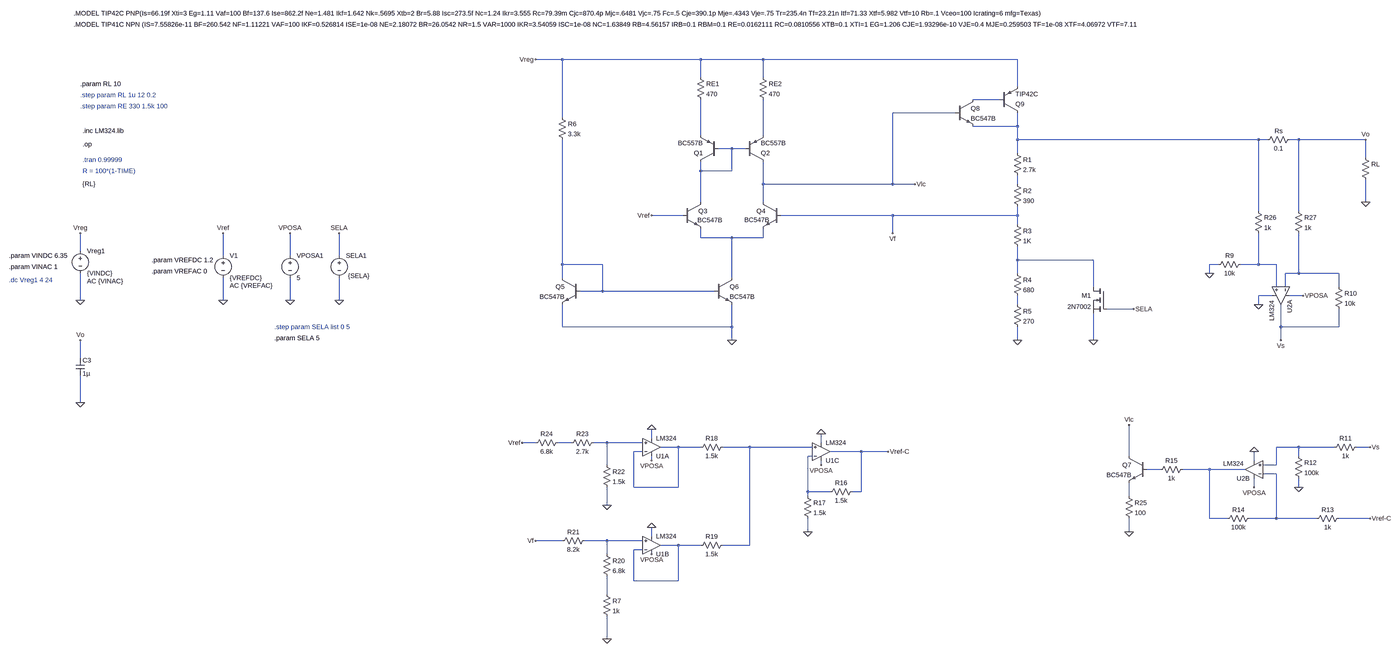
[diagram p0: schematic Simulacion - v10.asc, whole sheet]
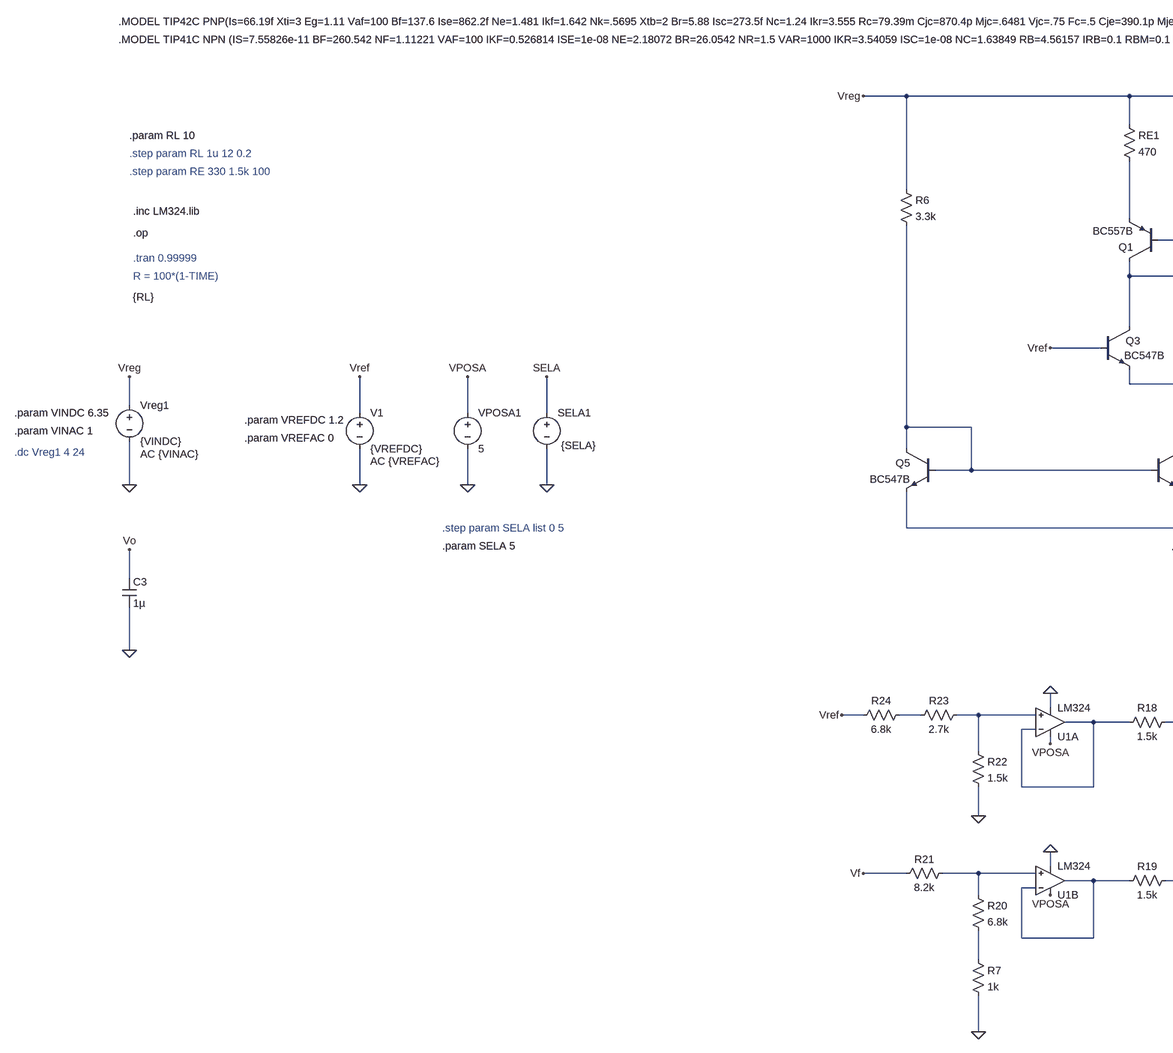
[diagram p1: schematic Simulacion - v10.asc, part, row 1 of 1, column 1 of 2]
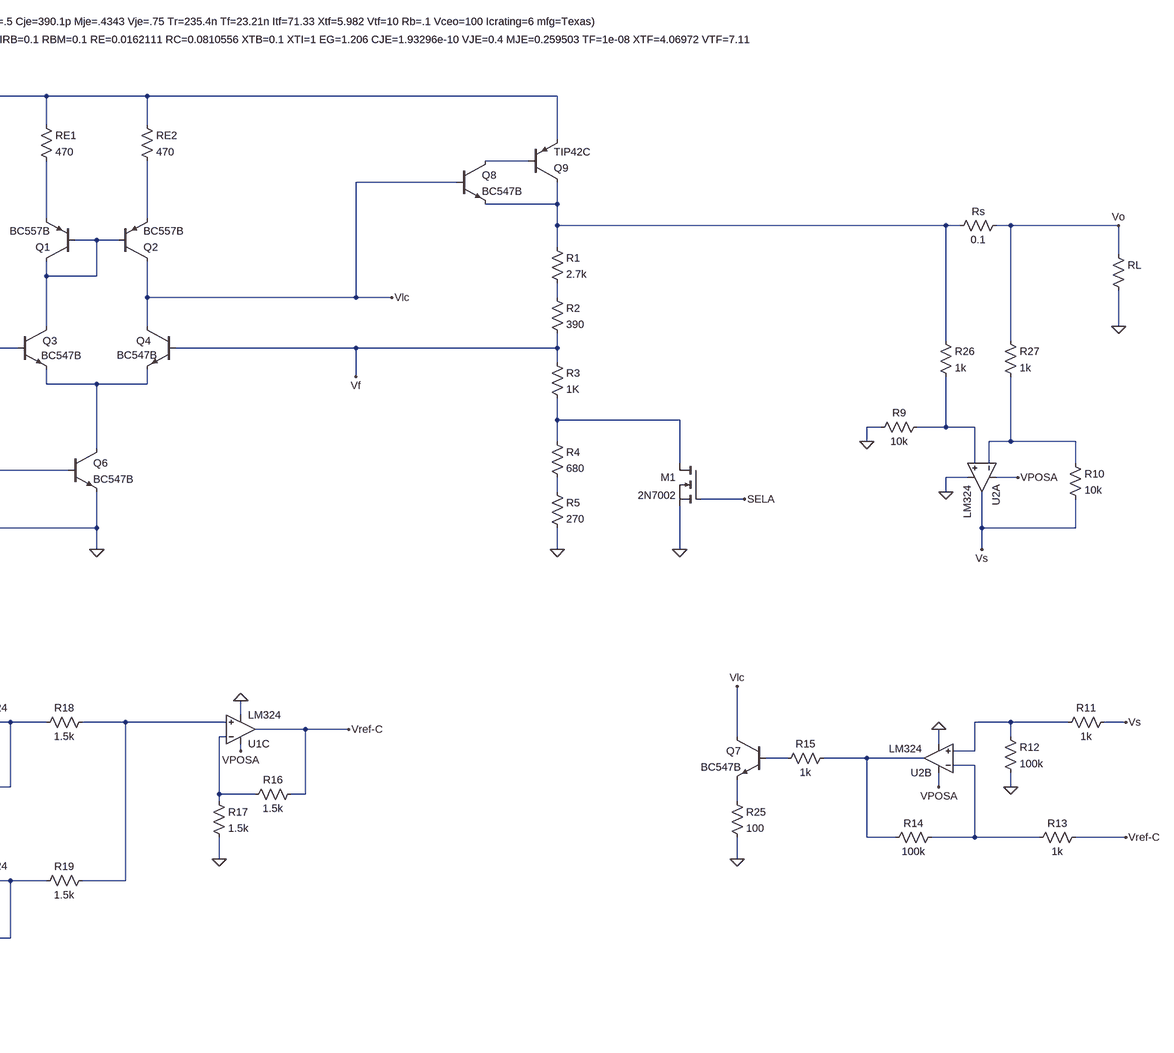
[diagram p2: schematic Simulacion - v10.asc, part, row 1 of 1, column 2 of 2]
Simulacion - v10.asc, the LTspice schematic file:
Version 4
SHEET 1 10276 2748
WIRE -160 -288 -256 -288
WIRE 336 -288 -160 -288
WIRE 560 -288 336 -288
WIRE 1472 -288 560 -288
WIRE 336 -224 336 -288
WIRE 560 -224 560 -288
WIRE 1472 -192 1472 -288
WIRE 1408 -144 1312 -144
WIRE 1248 -96 1024 -96
WIRE -160 -80 -160 -288
WIRE 1472 -48 1472 -96
WIRE 1472 -48 1312 -48
WIRE 336 -16 336 -144
WIRE 560 -16 560 -144
WIRE 1472 0 1472 -48
WIRE 2336 0 1472 0
WIRE 2368 0 2336 0
WIRE 2480 0 2448 0
WIRE 2720 0 2480 0
WIRE 448 32 400 32
WIRE 496 32 448 32
WIRE 1472 48 1472 0
WIRE 2720 64 2720 0
WIRE 336 112 336 80
WIRE 448 112 448 32
WIRE 448 112 336 112
WIRE 560 160 560 80
WIRE 1024 160 1024 -96
WIRE 1024 160 560 160
WIRE 1104 160 1024 160
WIRE 1472 160 1472 128
WIRE 336 224 336 112
WIRE 560 224 560 160
WIRE 2720 224 2720 144
WIRE 2336 256 2336 0
WIRE 2480 256 2480 0
WIRE 272 272 160 272
WIRE 1024 272 624 272
WIRE 1472 272 1472 240
WIRE 1472 272 1024 272
WIRE 1472 304 1472 272
WIRE 1024 336 1024 272
WIRE 336 352 336 320
WIRE 448 352 336 352
WIRE 560 352 560 320
WIRE 560 352 448 352
WIRE -1888 400 -1888 336
WIRE -1376 416 -1376 336
WIRE -1136 416 -1136 336
WIRE -960 416 -960 336
WIRE 1472 432 1472 384
WIRE 1744 432 1472 432
WIRE -160 448 -160 0
WIRE -16 448 -160 448
WIRE 2192 448 2160 448
WIRE 2336 448 2336 336
WIRE 2336 448 2272 448
WIRE 2400 448 2336 448
WIRE 1472 480 1472 432
WIRE 2160 480 2160 448
WIRE 2480 480 2480 336
WIRE 2480 480 2432 480
WIRE 2624 480 2480 480
WIRE -160 496 -160 448
WIRE 448 496 448 352
WIRE 1744 528 1744 432
WIRE 2400 528 2400 448
WIRE 2432 528 2432 480
WIRE 2624 528 2624 480
WIRE -16 544 -16 448
WIRE -16 544 -96 544
WIRE 384 544 -16 544
WIRE 2384 560 2336 560
WIRE 2496 560 2448 560
WIRE -1888 576 -1888 480
WIRE -1376 576 -1376 496
WIRE -1136 576 -1136 496
WIRE -960 576 -960 496
WIRE 1472 592 1472 560
WIRE 2336 592 2336 560
WIRE 1888 608 1792 608
WIRE -160 672 -160 592
WIRE 448 672 448 592
WIRE 448 672 -160 672
WIRE 2416 672 2416 592
WIRE 2624 672 2624 608
WIRE 2624 672 2416 672
WIRE 448 720 448 672
WIRE 1472 720 1472 672
WIRE 1744 720 1744 624
WIRE 2416 720 2416 672
WIRE -1888 784 -1888 720
WIRE -1888 944 -1888 848
WIRE 160 1072 160 1040
WIRE -256 1088 -304 1088
WIRE -128 1088 -176 1088
WIRE 0 1088 -48 1088
WIRE 128 1088 0 1088
WIRE 768 1088 768 1056
WIRE 256 1104 192 1104
WIRE 336 1104 256 1104
WIRE 512 1104 416 1104
WIRE 736 1104 512 1104
WIRE 2480 1104 2400 1104
WIRE 2608 1104 2480 1104
WIRE 2736 1104 2688 1104
WIRE 128 1120 96 1120
WIRE 912 1120 800 1120
WIRE 1008 1120 912 1120
WIRE 736 1136 720 1136
WIRE 1872 1136 1872 1024
WIRE 2480 1136 2480 1104
WIRE 160 1152 160 1136
WIRE 2320 1152 2320 1120
WIRE 0 1168 0 1088
WIRE 768 1168 768 1152
WIRE 2400 1168 2400 1104
WIRE 2400 1168 2352 1168
WIRE 1984 1184 1936 1184
WIRE 2160 1184 2064 1184
WIRE 2288 1184 2160 1184
WIRE 2400 1200 2352 1200
WIRE 96 1248 96 1120
WIRE 256 1248 256 1104
WIRE 256 1248 96 1248
WIRE 2320 1248 2320 1216
WIRE 2480 1248 2480 1216
WIRE 720 1264 720 1136
WIRE 800 1264 720 1264
WIRE 912 1264 912 1120
WIRE 912 1264 880 1264
WIRE 720 1280 720 1264
WIRE 1872 1280 1872 1232
WIRE 0 1312 0 1248
WIRE 2160 1360 2160 1184
WIRE 2224 1360 2160 1360
WIRE 2400 1360 2400 1200
WIRE 2400 1360 2304 1360
WIRE 2544 1360 2400 1360
WIRE 2736 1360 2624 1360
WIRE 720 1408 720 1360
WIRE 1872 1408 1872 1360
WIRE 160 1424 160 1392
WIRE -160 1440 -256 1440
WIRE 0 1440 -80 1440
WIRE 128 1440 0 1440
WIRE 256 1456 192 1456
WIRE 336 1456 256 1456
WIRE 512 1456 512 1104
WIRE 512 1456 416 1456
WIRE 128 1472 96 1472
WIRE 0 1488 0 1440
WIRE 96 1584 96 1472
WIRE 256 1584 256 1456
WIRE 256 1584 96 1584
WIRE 0 1632 0 1568
WIRE 0 1792 0 1712
FLAG 1024 336 Vf
FLAG 2480 1248 0
FLAG 1872 1408 0
FLAG -1376 576 0
FLAG 0 1312 0
FLAG 0 1792 0
FLAG 720 1408 0
FLAG 2720 224 0
FLAG -1888 944 0
FLAG 160 1152 VPOSA
FLAG 768 1168 VPOSA
FLAG 2496 560 VPOSA
FLAG 2320 1248 VPOSA
FLAG 160 1488 VPOSA
FLAG -1888 576 0
FLAG 1744 720 0
FLAG 1472 720 0
FLAG -960 576 0
FLAG 448 720 0
FLAG 2720 0 Vo
FLAG -1136 576 0
FLAG -1136 336 VPOSA
FLAG 160 272 Vref
FLAG 2160 480 0
FLAG 160 1392 0
FLAG 160 1040 0
FLAG 768 1056 0
FLAG 2320 1120 0
FLAG 2336 592 0
FLAG -256 1440 Vf
FLAG -304 1088 Vref
FLAG 2736 1360 Vref-C
FLAG 2736 1104 Vs
FLAG 2416 720 Vs
FLAG 1872 1024 Vlc
FLAG 1104 160 Vlc
FLAG 1008 1120 Vref-C
FLAG -256 -288 Vreg
FLAG -1888 336 Vreg
FLAG -1376 336 Vref
FLAG 1888 608 SELA
FLAG -960 336 SELA
FLAG -1888 720 Vo
SYMBOL pnp 400 80 R180
SYMATTR InstName Q1
SYMATTR Value BC557B
SYMBOL pnp 496 80 M180
SYMATTR InstName Q2
SYMATTR Value BC557B
SYMBOL npn 272 224 R0
WINDOW 3 52 65 Left 2
SYMATTR Value BC547B
SYMATTR InstName Q3
SYMBOL npn 624 224 M0
WINDOW 3 42 64 Left 2
SYMATTR Value BC547B
SYMATTR InstName Q4
SYMBOL pnp 1408 -96 M180
SYMATTR InstName Q9
SYMATTR Value TIP42C
SYMBOL npn 1248 -144 R0
SYMATTR InstName Q8
SYMATTR Value BC547B
SYMBOL res 1456 144 R0
SYMATTR InstName R2
SYMATTR Value 390
SYMBOL res 1456 288 R0
SYMATTR InstName R3
SYMATTR Value 1K
SYMBOL res 2704 48 R0
WINDOW 3 -4585 111 Left 2
SYMATTR Value {RL}
SYMATTR InstName RL
SYMBOL voltage -1376 400 R0
WINDOW 123 24 124 Left 2
WINDOW 39 0 0 Left 0
SYMATTR Value2 AC {VREFAC}
SYMATTR InstName V1
SYMATTR Value {VREFDC}
SYMBOL voltage -1888 384 R0
WINDOW 123 24 124 Left 2
WINDOW 39 0 0 Left 0
SYMATTR Value2 AC {VINAC}
SYMATTR InstName Vreg1
SYMATTR Value {VINDC}
SYMBOL res 320 -240 R0
SYMATTR InstName RE1
SYMATTR Value 470
SYMBOL res 544 -240 R0
SYMATTR InstName RE2
SYMATTR Value 470
SYMBOL cap -1904 784 R0
SYMATTR InstName C3
SYMATTR Value 1µ
SYMBOL res 2464 -16 R90
WINDOW 0 0 56 VBottom 2
WINDOW 3 32 56 VTop 2
SYMATTR InstName Rs
SYMATTR Value 0.1
SYMBOL res 2704 1088 R90
WINDOW 0 0 56 VBottom 2
WINDOW 3 32 56 VTop 2
SYMATTR InstName R11
SYMATTR Value 1k
SYMBOL res 2640 1344 R90
WINDOW 0 0 56 VBottom 2
WINDOW 3 32 56 VTop 2
SYMATTR InstName R13
SYMATTR Value 1k
SYMBOL res 2464 1120 R0
SYMATTR InstName R12
SYMATTR Value 100k
SYMBOL res 2320 1344 R90
WINDOW 0 0 56 VBottom 2
WINDOW 3 32 56 VTop 2
SYMATTR InstName R14
SYMATTR Value 100k
SYMBOL res 2080 1168 R90
WINDOW 0 0 56 VBottom 2
WINDOW 3 32 56 VTop 2
SYMATTR InstName R15
SYMATTR Value 1k
SYMBOL res 1856 1264 R0
SYMATTR InstName R25
SYMATTR Value 100
SYMBOL npn 1936 1136 M0
SYMATTR InstName Q7
SYMATTR Value BC547B
SYMBOL res -160 1072 R90
WINDOW 0 0 56 VBottom 2
WINDOW 3 32 56 VTop 2
SYMATTR InstName R24
SYMATTR Value 6.8k
SYMBOL res -16 1152 R0
SYMATTR InstName R22
SYMATTR Value 1.5k
SYMBOL res 432 1088 R90
WINDOW 0 0 56 VBottom 2
WINDOW 3 32 56 VTop 2
SYMATTR InstName R18
SYMATTR Value 1.5k
SYMBOL res -64 1424 R90
WINDOW 0 0 56 VBottom 2
WINDOW 3 32 56 VTop 2
SYMATTR InstName R21
SYMATTR Value 8.2k
SYMBOL res -16 1472 R0
SYMATTR InstName R20
SYMATTR Value 6.8k
SYMBOL res 432 1440 R90
WINDOW 0 0 56 VBottom 2
WINDOW 3 32 56 VTop 2
SYMATTR InstName R19
SYMATTR Value 1.5k
SYMBOL res 896 1248 R90
WINDOW 0 0 56 VBottom 2
WINDOW 3 32 56 VTop 2
SYMATTR InstName R16
SYMATTR Value 1.5k
SYMBOL res 704 1264 R0
SYMATTR InstName R17
SYMATTR Value 1.5k
SYMBOL res 1456 464 R0
SYMATTR InstName R4
SYMATTR Value 680
SYMBOL nmos 1792 528 M0
SYMATTR InstName M1
SYMATTR Value 2N7002
SYMBOL voltage -960 400 R0
WINDOW 3 32 89 Left 2
WINDOW 123 0 0 Left 0
WINDOW 39 0 0 Left 0
SYMATTR Value {SELA}
SYMATTR InstName SELA1
SYMBOL npn 384 496 R0
SYMATTR InstName Q6
SYMATTR Value BC547B
SYMBOL npn -96 496 M0
SYMATTR InstName Q5
SYMATTR Value BC547B
SYMBOL res -176 -96 R0
SYMATTR InstName R6
SYMATTR Value 3.3k
SYMBOL res 1456 32 R0
SYMATTR InstName R1
SYMATTR Value 2.7k
SYMBOL OpAmps\\opamp2 2480 560 R90
SYMATTR InstName U2A
SYMATTR Value LM324
SYMBOL OpAmps\\opamp2 2320 1248 R180
WINDOW 3 36 85 Left 2
SYMATTR Value LM324
SYMATTR InstName U2B
SYMBOL OpAmps\\opamp2 160 1168 M180
SYMATTR InstName U1A
SYMATTR Value LM324
SYMBOL OpAmps\\opamp2 768 1184 M180
SYMATTR InstName U1C
SYMATTR Value LM324
SYMBOL voltage -1136 400 R0
SYMATTR InstName VPOSA1
SYMATTR Value 5
SYMBOL res -32 1072 R90
WINDOW 0 0 56 VBottom 2
WINDOW 3 32 56 VTop 2
SYMATTR InstName R23
SYMATTR Value 2.7k
SYMBOL res 2608 512 R0
SYMATTR InstName R10
SYMATTR Value 10k
SYMBOL res 2320 240 R0
SYMATTR InstName R26
SYMATTR Value 1k
SYMBOL res 2464 240 R0
SYMATTR InstName R27
SYMATTR Value 1k
SYMBOL res 2288 432 R90
WINDOW 0 0 56 VBottom 2
WINDOW 3 32 56 VTop 2
SYMATTR InstName R9
SYMATTR Value 10k
SYMBOL res 1456 576 R0
SYMATTR InstName R5
SYMATTR Value 270
SYMBOL OpAmps\\opamp2 160 1520 M180
SYMATTR InstName U1B
SYMATTR Value LM324
SYMBOL res -16 1616 R0
SYMATTR InstName R7
SYMATTR Value 1k
TEXT -1880 16 Left 2 !.op
TEXT -2144 416 Left 2 !.param VINDC 6.35
TEXT -2144 456 Left 2 !.param VINAC 1
TEXT -1632 432 Left 2 !.param VREFDC 1.2
TEXT -1632 472 Left 2 !.param VREFAC 0
TEXT -1888 -200 Left 2 !.param RL 10
TEXT -2144 504 Left 2 ;.dc Vreg1 4 24
TEXT -1888 -120 Left 2 ;.step param RE 330 1.5k 100
TEXT -1888 -160 Left 2 ;.step param RL 1u 12 0.2
TEXT -1912 -544 Left 2 !.MODEL TIP42C PNP(Is=66.19f Xti=3 Eg=1.11 Vaf=100 Bf=137.6 Ise=862.2f Ne=1.481 Ikf=1.642 Nk=.5695 Xtb=2 Br=5.88 Isc=273.5f Nc=1.24 Ikr=3.555 Rc=79.39m Cjc=870.4p Mjc=.6481 Vjc=.75 Fc=.5 Cje=390.1p Mje=.4343 Vje=.75 Tr=235.4n Tf=23.21n Itf=71.33 Xtf=5.982 Vtf=10 Rb=.1 Vceo=100 Icrating=6 mfg=Texas)
TEXT -1912 -504 Left 2 !.MODEL TIP41C NPN (IS=7.55826e-11 BF=260.542 NF=1.11221 VAF=100 IKF=0.526814 ISE=1e-08 NE=2.18072 BR=26.0542 NR=1.5 VAR=1000 IKR=3.54059 ISC=1e-08 NC=1.63849 RB=4.56157 IRB=0.1 RBM=0.1 RE=0.0162111 RC=0.0810556 XTB=0.1 XTI=1 EG=1.206 CJE=1.93296e-10 VJE=0.4 MJE=0.259503 TF=1e-08 XTF=4.06972 VTF=7.1157 ITF=0.001 CJC=1.09657e-10 VJC=0.730921 MJC=0.23 XCJC=0.803085 FC=0.8 TR=9.01013e-08 PTF=0 Vceo=100 ICrating=6 mfg=ON_Semi)
TEXT -1880 -32 Left 2 !.inc LM324.lib
TEXT -1880 72 Left 2 ;.tran 0.99999
TEXT -1880 112 Left 2 ;R = 100*(1-TIME)
TEXT -1192 672 Left 2 ;.step param SELA list 0 5
TEXT -1192 712 Left 2 !.param SELA 5

The netlist it stands for:
* Simulacion - v10.asc
Q1 N005 N005 N003 0 BC557B
Q2 Vlc N005 N004 0 BC557B
Q3 N005 Vref N007 0 BC547B
Q4 Vlc Vf N007 0 BC547B
Q9 N002 N001 Vreg 0 TIP42C
Q8 N001 Vlc N002 0 BC547B
R2 N006 Vf 390
R3 Vf N008 1K
RL Vo 0 {RL}
V1 Vref 0 {VREFDC} AC {VREFAC}
Vreg1 Vreg 0 {VINDC} AC {VINAC}
RE1 Vreg N003 470
RE2 Vreg N004 470
C3 Vo 0 1µ
Rs Vo N002 0.1
R11 Vs N017 1k
R13 Vref-C N021 1k
R12 N017 0 100k
R14 N021 N020 100k
R15 N020 N019 1k
R25 N022 0 100
Q7 Vlc N019 N022 0 BC547B
R24 N013 Vref 6.8k
R22 N014 0 1.5k
R18 N016 N015 1.5k
R21 N023 Vf 8.2k
R20 N023 N025 6.8k
R19 N016 N024 1.5k
R16 Vref-C N018 1.5k
R17 N018 0 1.5k
R4 N008 N012 680
M1 N008 SELA 0 0 2N7002
V§SELA1 SELA 0 {SELA}
Q6 N007 N009 0 0 BC547B
Q5 N009 N009 0 0 BC547B
R6 Vreg N009 3.3k
R1 N002 N006 2.7k
XU2A N010 N011 VPOSA 0 Vs LM324  ; pins In+ In- V+ V- OUT
XU2B N017 N021 VPOSA 0 N020 LM324  ; pins In+ In- V+ V- OUT
XU1A N014 N015 VPOSA 0 N015 LM324  ; pins In+ In- V+ V- OUT
XU1C N016 N018 VPOSA 0 Vref-C LM324  ; pins In+ In- V+ V- OUT
VPOSA1 VPOSA 0 5
R23 N014 N013 2.7k
R10 N011 Vs 10k
R26 N002 N010 1k
R27 Vo N011 1k
R9 N010 0 10k
R5 N012 0 270
XU1B N023 N024 VPOSA 0 N024 LM324  ; pins In+ In- V+ V- OUT
R7 N025 0 1k
.model NPN NPN
.model PNP PNP
.lib standard.bjt
.model NMOS NMOS
.model PMOS PMOS
.lib standard.mos
.op
.param VINDC 6.35
.param VINAC 1
.param VREFDC 1.2
.param VREFAC 0
.param RL 10
* .dc Vreg1 4 24
* .step param RE 330 1.5k 100
* .step param RL 1u 12 0.2
.MODEL TIP42C PNP(Is=66.19f Xti=3 Eg=1.11 Vaf=100 Bf=137.6 Ise=862.2f Ne=1.481 Ikf=1.642 Nk=.5695 Xtb=2 Br=5.88 Isc=273.5f Nc=1.24 Ikr=3.555 Rc=79.39m Cjc=870.4p Mjc=.6481 Vjc=.75 Fc=.5 Cje=390.1p Mje=.4343 Vje=.75 Tr=235.4n Tf=23.21n Itf=71.33 Xtf=5.982 Vtf=10 Rb=.1 Vceo=100 Icrating=6 mfg=Texas)
.MODEL TIP41C NPN (IS=7.55826e-11 BF=260.542 NF=1.11221 VAF=100 IKF=0.526814 ISE=1e-08 NE=2.18072 BR=26.0542 NR=1.5 VAR=1000 IKR=3.54059 ISC=1e-08 NC=1.63849 RB=4.56157 IRB=0.1 RBM=0.1 RE=0.0162111 RC=0.0810556 XTB=0.1 XTI=1 EG=1.206 CJE=1.93296e-10 VJE=0.4 MJE=0.259503 TF=1e-08 XTF=4.06972 VTF=7.1157 ITF=0.001 CJC=1.09657e-10 VJC=0.730921 MJC=0.23 XCJC=0.803085 FC=0.8 TR=9.01013e-08 PTF=0 Vceo=100 ICrating=6 mfg=ON_Semi)
.inc LM324.lib
* .tran 0.99999
* R = 100*(1-TIME)
* .step param SELA list 0 5
.param SELA 5
.backanno
.end